# Altium schematic sheet 02-WWVB_Path.SchDoc
size B; SheetNumber: 2; SheetTotal: 8
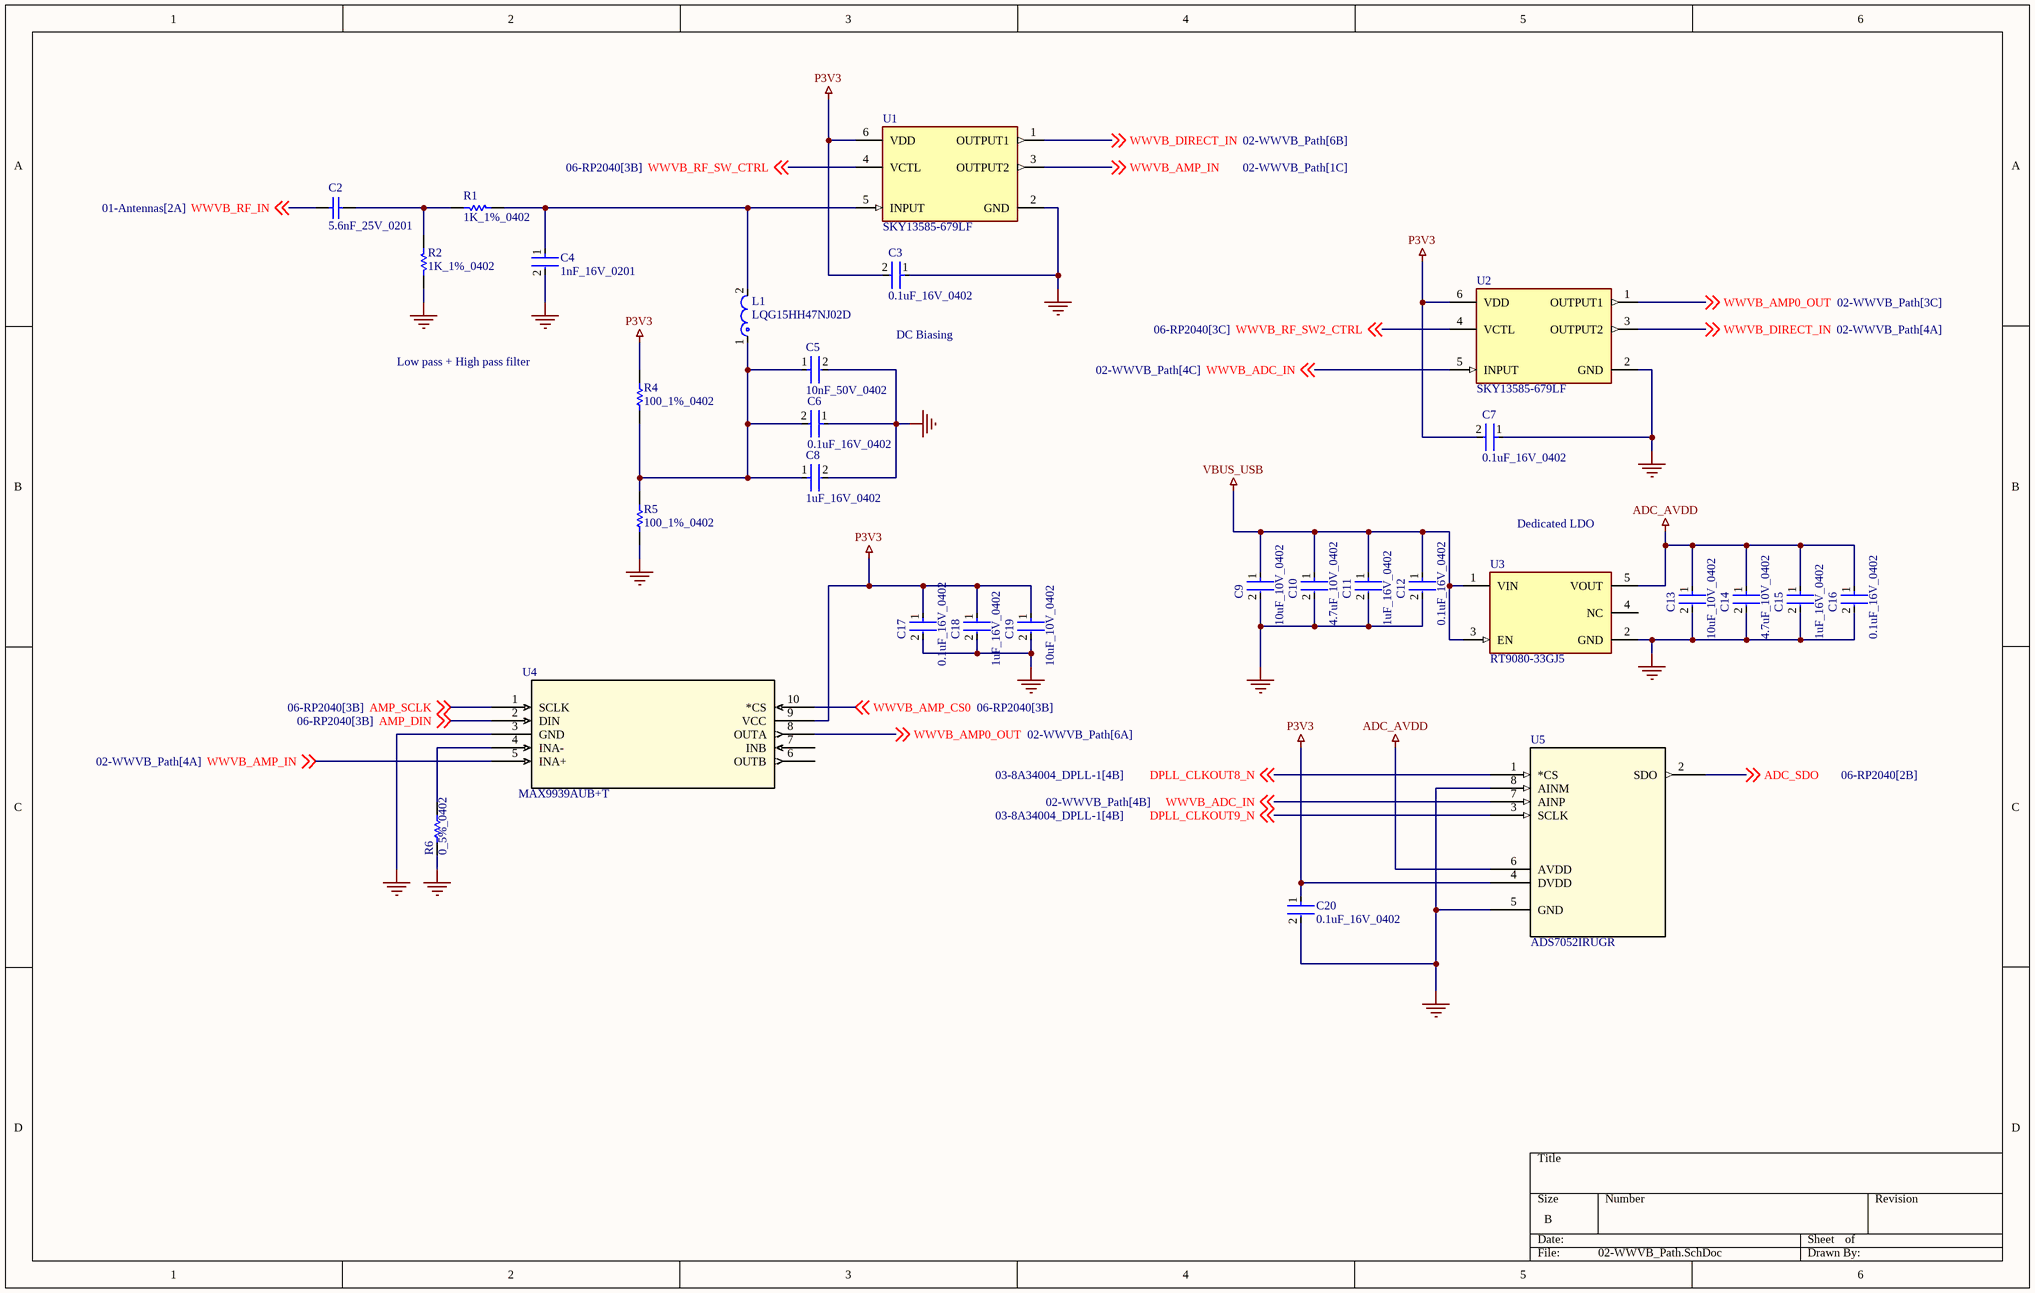
[diagram p0: 02-WWVB_Path.SchDoc]

## Parts
C2  5.6nF_25V_0201  [CAPC0603X33X15ML03T05]
C3  0.1uF_16V_0402  [FP-C0402-BB-MFG]
C4  1nF_16V_0201  [FP-0201-L_0_6_0_09-W_0_3-MFG]
C5  10nF_50V_0402  [FP-CL165-IPC_C]
C6  0.1uF_16V_0402  [FP-C0402-BB-MFG]
C7  0.1uF_16V_0402  [FP-C0402-BB-MFG]
C8  1uF_16V_0402  [FP-0402-L_1_0_0_05-W_0_5-IPC_A]
C9  10uF_10V_0402  [FP-CL05A106MP5NUNC-MFG]
C10  4.7uF_10V_0402  [FP-C1005-050-0_15-MFG]
C11  1uF_16V_0402  [FP-0402-L_1_0_0_05-W_0_5-IPC_A]
C12  0.1uF_16V_0402  [FP-C0402-BB-MFG]
C13  10uF_10V_0402  [FP-CL05A106MP5NUNC-MFG]
C14  4.7uF_10V_0402  [FP-C1005-050-0_15-MFG]
C15  1uF_16V_0402  [FP-0402-L_1_0_0_05-W_0_5-IPC_A]
C16  0.1uF_16V_0402  [FP-C0402-BB-MFG]
C17  0.1uF_16V_0402  [FP-C0402-BB-MFG]
C18  1uF_16V_0402  [FP-0402-L_1_0_0_05-W_0_5-IPC_A]
C19  10uF_10V_0402  [FP-CL05A106MP5NUNC-MFG]
C20  0.1uF_16V_0402  [FP-C0402-BB-MFG]
L1  LQG15HH47NJ02D  [FP-LQG15HH_02-IPC_C]
R1  1K_1%_0402  [RESC1005X40X25NL05T05]
R2  1K_1%_0402  [RESC1005X40X25NL05T05]
R4  100_1%_0402  [RESC1005X40X25ML05T10]
R5  100_1%_0402  [RESC1005X40X25ML05T10]
R6  0_5%_0402  [RESC1005X40X25NL05T10]
U1  SKY13585-679LF  [FP-SKY13585-679LF-MFG]
U2  SKY13585-679LF  [FP-SKY13585-679LF-MFG]
U3  RT9080-33GJ5  [FP-RT9080-33GJ5-IPC_C]
U4  MAX9939AUB+T  [21-0061L_MXM]
U5  ADS7052IRUGR  [RUG8_TEX]

## Nets
ADC_AVDD: C13.1 C14.1 C15.1 C16.1 U3.5(VOUT) U5.6(AVDD)
GND: C3.1 C4.2 C5.2 C6.1 C7.1 C8.2 C9.2 C10.2 C11.2 C12.2 C13.2 C14.2 C15.2 C16.2 C17.2 C18.2 C19.2 C20.2 R2.1 R5.1 R6.1 U1.2(GND) U2.2(GND) U3.2(GND) U4.3(GND) U5.5(GND) U5.8(AINM)
P3V3: C3.2 C7.2 C17.1 C18.1 C19.1 C20.1 R4.2 U1.6(VDD) U2.6(VDD) U4.9(VCC) U5.4(DVDD)
VBUS_USB: C9.1 C10.1 C11.1 C12.1 U3.1(VIN) U3.3(EN)
ADC_SDO: U5.2(SDO) ; off-sheet ADC_SDO
AMP_DIN: U4.2(DIN) ; off-sheet AMP_DIN
AMP_SCLK: U4.1(SCLK) ; off-sheet AMP_SCLK
DPLL_CLKOUT8_N: U5.1(*CS) ; off-sheet DPLL_CLKOUT8_N
DPLL_CLKOUT9_N: U5.3(SCLK) ; off-sheet DPLL_CLKOUT9_N
WWVB_ADC_IN: U2.5(INPUT) U5.7(AINP) ; off-sheet WWVB_ADC_IN
WWVB_AMP0_OUT: U2.1(OUTPUT1) U4.8(OUTA) ; off-sheet WWVB_AMP0_OUT
WWVB_AMP_CS0: U4.10(*CS) ; off-sheet WWVB_AMP_CS0
WWVB_AMP_IN: U1.3(OUTPUT2) U4.5(INA+) ; off-sheet WWVB_AMP_IN
WWVB_DIRECT_IN: U1.1(OUTPUT1) U2.3(OUTPUT2) ; off-sheet WWVB_DIRECT_IN
WWVB_RF_IN: C2.1 ; off-sheet WWVB_RF_IN
WWVB_RF_SW2_CTRL: U2.4(VCTL) ; off-sheet WWVB_RF_SW2_CTRL
WWVB_RF_SW_CTRL: U1.4(VCTL) ; off-sheet WWVB_RF_SW_CTRL
NetC2_2: C2.2 R1.2 R2.2
NetC4_1: C4.1 L1.2 R1.1 U1.5(INPUT)
NetC5_1: C5.1 C6.2 C8.1 L1.1 R4.1 R5.2
NetR6_2: R6.2 U4.4(INA-)

Not connected (* = marked no-connect by the designer): U3 4(NC); U4 6(OUTB) 7(INB)

## Notes on the sheet
- Low pass + High pass filter
- DC Biasing
- Dedicated LDO

## Library data of the parts
C2 = CMP-2010-01745-1: Part Number: MC000322; Manufacturer: Multicomp
C3 C6 C7 C12 C16 C17 C20 = CMP-1034-02068-3: CAP CER 0.1UF 16V 5% X7R 0402; Manufacturer: Kemet; Manufacturer Part Number: C0402C104J4RACTU; Value: 0.10 μF; Temperature Coefficient: 15%; Tolerance: 0.05; Material: Ceramic; ComponentLink2URL: https://content.kemet.com/datasheets/KEM_C1002_X7R_SMD.pdf; Automotive: No; Device Class L2: Capacitors; Temperature: -55°C to +125°C; RoHS: TRUE; Voltage Rating: 16 V; ComponentLink2Description: Datasheet; Device Class L3: Ceramic Capacitors; Temperature Range Low: -55°C; Ipc Land Pattern Name: CAPC10050X50; Device Class L1: Passive Components; Temperature Range High: +125°C; Package: C0402-BB; Capacitance: 0.10 μF; Category: Cap; Mouser Description: CAP CER 0.1UF 16V X7R 0402; Height: 0.55mm; Digikey Description: CAP CER 0.1UF 16V 5% X7R 0402; Octopart: https://octopart.com/c0402c104j4ractu-kemet-12573893; Temperature Characteristic: X7R; Lead Free: Yes
C4 = CMP-2010-00182-2: General Purpose Ceramic Capacitor, 0201, 1nF, 10%, X7R, 15%, 16V; Dissipation Factor: 12.5%; Insulation Resistance: 100GR; Lead Free: Lead Free; Thickness: 0.013inch; Height: 0.33mm; Dielectric: X7R; Voltage Rating: 16V; Max Operating Temperature: 125°C; RoHS Compliant: Yes; Voltage: 16V; Package Quantity: 1; Mount: Surface Mount; Voltage Rating (DC): 16V; Dielectric Material: Ceramic; Termination: SMD/SMT; REACH SVHC: No SVHC; Case Code (Metric): 0603; Length: 0.6mm; Case/Package: 0201; Width: 0.012inch; Case Code (Imperial): 0201; Radiation Hardening: No; Tolerance: 10%; Series: -; Number of Pins: 2; Min Operating Temperature: -55°C; Capacitance: 1nF; Construction: Flat; Depth: 0.3mm; Packaging: Tape and Reel
C5 = CMP-13271-000387-1: Cap Ceramic 10nF 50V X7R ±10% SMD 0402 +125°C Paper T/R; Depth: 0.5mm; Length: 1mm; Lead Free: Lead Free; Case Code (Metric): 1005; Width: 0.02inch; Min Operating Temperature: -55°C; Thickness: 0.022inch; Package Quantity: 1; Mount: Surface Mount; Height: 0.5mm; Voltage: 50V; Material: Ceramic; Tolerance: 10%; Case Code (Imperial): 0402; Radiation Hardening: No; Case/Package: 0402; Max Operating Temperature: 125°C; Voltage Rating (DC): 50V; Contact Plating: Tin; Packaging: Tape and Reel; Voltage Rating: 50V; Capacitance: 10nF; Dielectric: X7R
C8 C11 C15 C18 = CMP-14477-000104-2: None; Tolerance: 10%; Voltage Rating: 16V; Dielectric: X5R; Capacitance: 1uF; Packaging: Tape and Reel; Depth: 0.5mm; Mount: Surface Mount; Thickness: 0.022inch; Package Quantity: 1; Min Operating Temperature: -55°C; Series: M; Voltage Rating (DC): 16V; Termination: SMD/SMT; Case/Package: 0402; Number of Pins: 2; Case Code (Imperial): 0402; Length: 1mm; Halogen Free: Halogen Free; Case Code (Metric): 1005; Width: 0.02inch; RoHS Compliant: Yes; Radiation Hardening: No; Max Operating Temperature: 85°C; Height: 0.5mm; Construction: Flat
C9 C13 C19 = CMP-13271-000002-1: CAP CER 10UF 10V X5R 0402; Manufacturer Part Number: CL05A106MP5NUNC; Manufacturer: Samsung; Temperature Coefficient: 15%; Tolerance: 20%; Material: Ceramic; Octopart: https://octopart.com/cl05a106mp5nunc-samsung-22457395; Voltage Rating: 10V; RoHS: TRUE; Value: 10uF; Height: 0.7mm; Digikey Description: CAP CER 10UF 10V X5R 0402; Automotive: No; Package: CL05A106MP5NUNC; Device Class L1: Passive Components; Capacitance: 10uF; Temperature Range High: +85°C; ComponentLink2Description: Datasheet; Device Class L2: Capacitors; Temperature Characteristic: X5R; Temperature: -55°C to +85°C; ComponentLink2URL: http://www.samsungsem.com/kr/support/product-search/mlcc/__icsFiles/afieldfile/2019/05/10/19-CL05A106MP5NUNC.pdf; Device Class L3: Ceramic Capacitors; Category: Cap; Temperature Range Low: -55°C; Ipc Land Pattern Name: CAPC10050X50; Lead Free: Yes
C10 C14 = CMP-2000-05997-2: CAP CER 4.7UF 10V X5R 0402; Dielectric Material: Ceramic; Tolerance: 10%; Series: C; Package Quantity: 10000; Max Operating Temperature: 85°C; Case Code (Imperial): 0402; Lead Free: Lead Free; Voltage Rating (DC): 10V; Packaging: Cut Tape; Voltage Rating: 10V; Min Operating Temperature: -55°C; Dielectric: X5R; Thickness: 0.022inch; Width: 0.02inch; Case/Package: 0402; Case Code (Metric): 1005; Capacitance: 4.7uF; Length: 0.039inch; RoHS Compliant: Yes; REACH SVHC: No SVHC; Mount: Surface Mount
L1 = CMP-06042-003301-1: Multilayer type Inductor for Automotive 47nH ±5% 0.72Ω 300mA 0402; Max DC Current: 200mA; Core Material: Air; Q Factor: 8; Test Frequency: 100MHz; Self Resonant Frequency: 1GHz; Shielding: Unshielded; DC Resistance (DCR): 720mR; Min Operating Temperature: -55°C; Package Quantity: 10000; Packaging: Tape and Reel; Case/Package: 0402; Height - Seated (Max): 0.022inch; Tolerance: 5%; Max Operating Temperature: 125°C; Mount: Surface Mount; Height: 0.5mm; Termination: SMD/SMT; Length: 0.039inch; Case Code (Metric): 1005; Current Rating: 200mA; Inductance: 47nH; Case Code (Imperial): 0402; Width: 0.02inch
R1 R2 = CMP-2002-08277-1: Manufacturer: Vishay Dale; Part Number: CRCW04021K00FKTD
R4 R5 = CMP-2002-06458-1: Part Number: ERJ-U02F1000X; Manufacturer: Panasonic
R6 = CMP-2002-06457-1: Manufacturer: Panasonic; Part Number: ERJ-U020R00X
U1 U2 = CMP-85923-000009-1: IC RF SWITCH SPDT 6GHZ 6MLPD; Insertion Loss: 0.5dB; Impedance: 50R; IIP3: 56dBm; Test Frequency: 2.5GHz; Packaging: Cut Tape; Throw Configuration: SPDT; Max Operating Temperature: 90°C; RoHS Compliant: Yes; Min Operating Temperature: -40°C; Series: -
U3 = CMP-79890-000003-1: IC REG LIN 3.3V 600MA TSOT23-5; Power Supply Rejection Ratio (PSRR): 75dB; Output Type: Fixed; Max Input Voltage: 5.5V; Dropout Voltage: 530mV; Output Configuration: Positive; Quiescent Current: 4uA; Number of Regulators: 1; Packaging: Cut Tape; RoHS Compliant: Yes; Mount: Surface Mount; Max Operating Temperature: 85°C; Min Output Voltage: 3.3V; Output Current: 600mA; Min Operating Temperature: -40°C; Case/Package: SOT-23-5
U4 = MAX9939AUB+T: No Description Available; Mfr_Name: Analog Devices Inc; Copyright: Copyright (C) 2023 Ultra Librarian. All rights reserved.; Manufacturer_Part_Number: MAX9939AUB+T; RefDes: RefDes; Type: DEV
U5 = ADS7052IRUGR: No Description Available; Mfr_Name: Texas Instruments; RefDes: RefDes; Type: Type